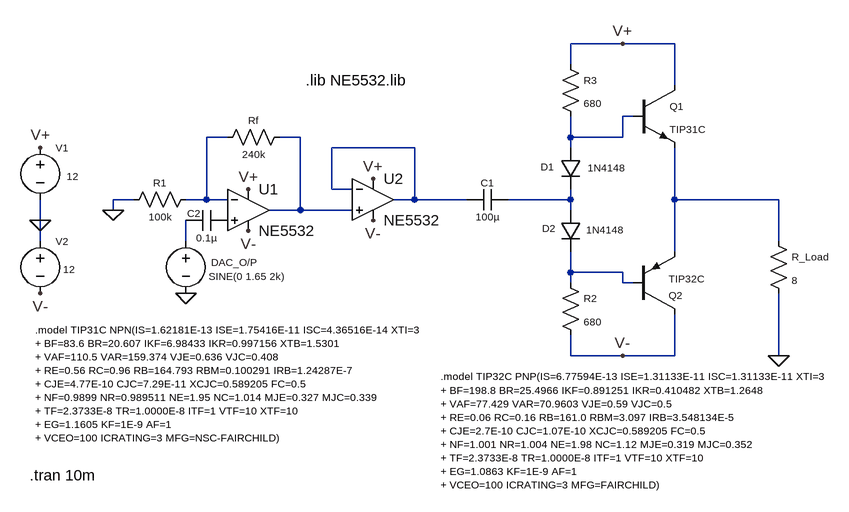
[diagram p0: schematic output_amp.asc]
output_amp.asc, the LTspice schematic file:
Version 4.1
SHEET 1 1148 680
WIRE 800 -96 720 -96
WIRE 880 -96 800 -96
WIRE 720 -64 720 -96
WIRE 880 -32 880 -96
WIRE 816 16 800 16
WIRE 192 48 160 48
WIRE 304 48 272 48
WIRE 720 48 720 16
WIRE 800 48 800 16
WIRE 800 48 720 48
WIRE 480 64 352 64
WIRE 720 64 720 48
WIRE 352 128 352 64
WIRE 384 128 352 128
WIRE 48 144 16 144
WIRE 160 144 160 48
WIRE 160 144 128 144
WIRE 192 144 160 144
WIRE 480 144 480 64
WIRE 480 144 448 144
WIRE 560 144 480 144
WIRE 720 144 720 128
WIRE 720 144 624 144
WIRE 880 144 880 64
WIRE 1040 144 880 144
WIRE 16 160 16 144
WIRE 304 160 304 48
WIRE 304 160 256 160
WIRE 384 160 304 160
WIRE 720 160 720 144
WIRE -96 176 -96 144
WIRE -96 208 -96 176
WIRE 128 208 128 176
WIRE 1040 208 1040 144
WIRE 880 224 880 144
WIRE 720 256 720 224
WIRE 800 256 720 256
WIRE 720 272 720 256
WIRE 800 272 800 256
WIRE 816 272 800 272
WIRE 720 384 720 352
WIRE 800 384 720 384
WIRE 880 384 880 320
WIRE 880 384 800 384
WIRE 1040 384 1040 288
FLAG 128 288 0
FLAG 16 160 0
FLAG -96 176 0
FLAG -96 64 V+
FLAG -96 288 V-
FLAG 224 128 V+
FLAG 416 112 V+
FLAG 224 192 V-
FLAG 416 176 V-
FLAG 800 -96 V+
FLAG 1040 384 0
FLAG 800 384 V-
SYMBOL voltage 128 192 R0
WINDOW 0 39 48 Left 1
WINDOW 3 35 70 Left 1
WINDOW 123 0 0 Left 0
WINDOW 39 0 0 Left 0
SYMATTR InstName DAC_O/P
SYMATTR Value SINE(0 1.65 2k)
SYMBOL res 144 128 R90
WINDOW 0 0 56 VBottom 1
WINDOW 3 32 56 VTop 1
SYMATTR InstName R1
SYMATTR Value 100k
SYMBOL res 288 32 R90
WINDOW 0 0 56 VBottom 1
WINDOW 3 32 56 VTop 1
SYMATTR InstName Rf
SYMATTR Value 240k
SYMBOL voltage -96 48 R0
WINDOW 0 24 16 Left 1
WINDOW 3 41 60 Left 1
WINDOW 123 0 0 Left 0
WINDOW 39 0 0 Left 0
SYMATTR InstName V1
SYMATTR Value 12
SYMBOL voltage -96 192 R0
WINDOW 0 24 16 Left 1
WINDOW 3 35 59 Left 1
WINDOW 123 0 0 Left 0
WINDOW 39 0 0 Left 0
SYMATTR InstName V2
SYMATTR Value 12
SYMBOL npn 816 -32 R0
WINDOW 0 56 32 Left 1
WINDOW 3 56 68 Left 1
SYMATTR InstName Q1
SYMATTR Value TIP31C
SYMBOL pnp 816 320 M180
WINDOW 0 55 29 Left 1
WINDOW 3 55 54 Left 1
SYMATTR InstName Q2
SYMATTR Value TIP32C
SYMBOL res 704 256 R0
WINDOW 0 36 40 Left 1
WINDOW 3 36 76 Left 1
SYMATTR InstName R2
SYMATTR Value 680
SYMBOL res 704 -80 R0
WINDOW 0 36 40 Left 1
WINDOW 3 36 76 Left 1
SYMATTR InstName R3
SYMATTR Value 680
SYMBOL diode 704 64 R0
WINDOW 0 -30 29 Left 1
WINDOW 3 42 31 Left 1
SYMATTR InstName D1
SYMATTR Value 1N4148
SYMBOL diode 704 160 R0
WINDOW 0 -28 28 Left 1
WINDOW 3 40 30 Left 1
SYMATTR InstName D2
SYMATTR Value 1N4148
SYMBOL cap 624 128 R90
WINDOW 0 0 32 VBottom 1
WINDOW 3 32 32 VTop 1
SYMATTR InstName C1
SYMATTR Value 100µ
SYMBOL res 1024 192 R0
WINDOW 0 36 40 Left 1
WINDOW 3 36 76 Left 1
SYMATTR InstName R_Load
SYMATTR Value 8
SYMBOL cap 192 160 R90
WINDOW 0 15 52 VBottom 1
WINDOW 3 32 32 VTop 1
SYMATTR InstName C2
SYMATTR Value 0.1µ
SYMBOL OpAmps\\opamp2 224 96 R0
SYMATTR InstName U1
SYMATTR Value NE5532
SYMBOL OpAmps\\opamp2 416 80 R0
SYMATTR InstName U2
SYMATTR Value NE5532
TEXT -104 344 Left 1 !.model TIP31C NPN(IS=1.62181E-13 ISE=1.75416E-11 ISC=4.36516E-14 XTI=3\n+ BF=83.6 BR=20.607 IKF=6.98433 IKR=0.997156 XTB=1.5301\n+ VAF=110.5 VAR=159.374 VJE=0.636 VJC=0.408\n+ RE=0.56 RC=0.96 RB=164.793 RBM=0.100291 IRB=1.24287E-7\n+ CJE=4.77E-10 CJC=7.29E-11 XCJC=0.589205 FC=0.5\n+ NF=0.9899 NR=0.989511 NE=1.95 NC=1.014 MJE=0.327 MJC=0.339\n+ TF=2.3733E-8 TR=1.0000E-8 ITF=1 VTF=10 XTF=10\n+ EG=1.1605 KF=1E-9 AF=1\n+ VCEO=100 ICRATING=3 MFG=NSC-FAIRCHILD)
TEXT 520 416 Left 1 !.model TIP32C PNP(IS=6.77594E-13 ISE=1.31133E-11 ISC=1.31133E-11 XTI=3\n+ BF=198.8 BR=25.4966 IKF=0.891251 IKR=0.410482 XTB=1.2648\n+ VAF=77.429 VAR=70.9603 VJE=0.59 VJC=0.5\n+ RE=0.06 RC=0.16 RB=161.0 RBM=3.097 IRB=3.548134E-5\n+ CJE=2.7E-10 CJC=1.07E-10 XCJC=0.589205 FC=0.5\n+ NF=1.001 NR=1.004 NE=1.98 NC=1.12 MJE=0.319 MJC=0.352\n+ TF=2.3733E-8 TR=1.0000E-8 ITF=1 VTF=10 XTF=10\n+ EG=1.0863 KF=1E-9 AF=1\n+ VCEO=100 ICRATING=3 MFG=FAIRCHILD)
TEXT -112 568 Left 2 !.tran 10m
TEXT 312 -40 Left 2 !.lib NE5532.lib

The netlist it stands for:
* output_amp.asc
V§DAC_O/P N007 0 SINE(0 1.65 2k)
R1 N002 0 100k
Rf N003 N002 240k
V1 V+ 0 12
V2 0 V- 12
Q1 V+ N001 N006 0 TIP31C
Q2 V- N008 N006 0 TIP32C
R2 N008 V- 680
R3 V+ N001 680
D1 N001 N005 1N4148
D2 N005 N008 1N4148
C1 N005 N004 100µ
R_Load N006 0 8
C2 P001 N007 0.1µ
X§U1 P001 N002 V+ V- N003 NE5532  ; pins In+ In- V+ V- OUT
X§U2 N003 N004 V+ V- N004 NE5532  ; pins In+ In- V+ V- OUT
.model D D
.lib standard.dio
.model NPN NPN
.model PNP PNP
.lib standard.bjt
.model TIP31C NPN(IS=1.62181E-13 ISE=1.75416E-11 ISC=4.36516E-14 XTI=3
+ BF=83.6 BR=20.607 IKF=6.98433 IKR=0.997156 XTB=1.5301
+ VAF=110.5 VAR=159.374 VJE=0.636 VJC=0.408
+ RE=0.56 RC=0.96 RB=164.793 RBM=0.100291 IRB=1.24287E-7
+ CJE=4.77E-10 CJC=7.29E-11 XCJC=0.589205 FC=0.5
+ NF=0.9899 NR=0.989511 NE=1.95 NC=1.014 MJE=0.327 MJC=0.339
+ TF=2.3733E-8 TR=1.0000E-8 ITF=1 VTF=10 XTF=10
+ EG=1.1605 KF=1E-9 AF=1
+ VCEO=100 ICRATING=3 MFG=NSC-FAIRCHILD)
.model TIP32C PNP(IS=6.77594E-13 ISE=1.31133E-11 ISC=1.31133E-11 XTI=3
+ BF=198.8 BR=25.4966 IKF=0.891251 IKR=0.410482 XTB=1.2648
+ VAF=77.429 VAR=70.9603 VJE=0.59 VJC=0.5
+ RE=0.06 RC=0.16 RB=161.0 RBM=3.097 IRB=3.548134E-5
+ CJE=2.7E-10 CJC=1.07E-10 XCJC=0.589205 FC=0.5
+ NF=1.001 NR=1.004 NE=1.98 NC=1.12 MJE=0.319 MJC=0.352
+ TF=2.3733E-8 TR=1.0000E-8 ITF=1 VTF=10 XTF=10
+ EG=1.0863 KF=1E-9 AF=1
+ VCEO=100 ICRATING=3 MFG=FAIRCHILD)
.tran 10m
.lib NE5532.lib
.backanno
.end